# EAGLE design 80 LED WS2812 panels (EAGLE 9.6.2)
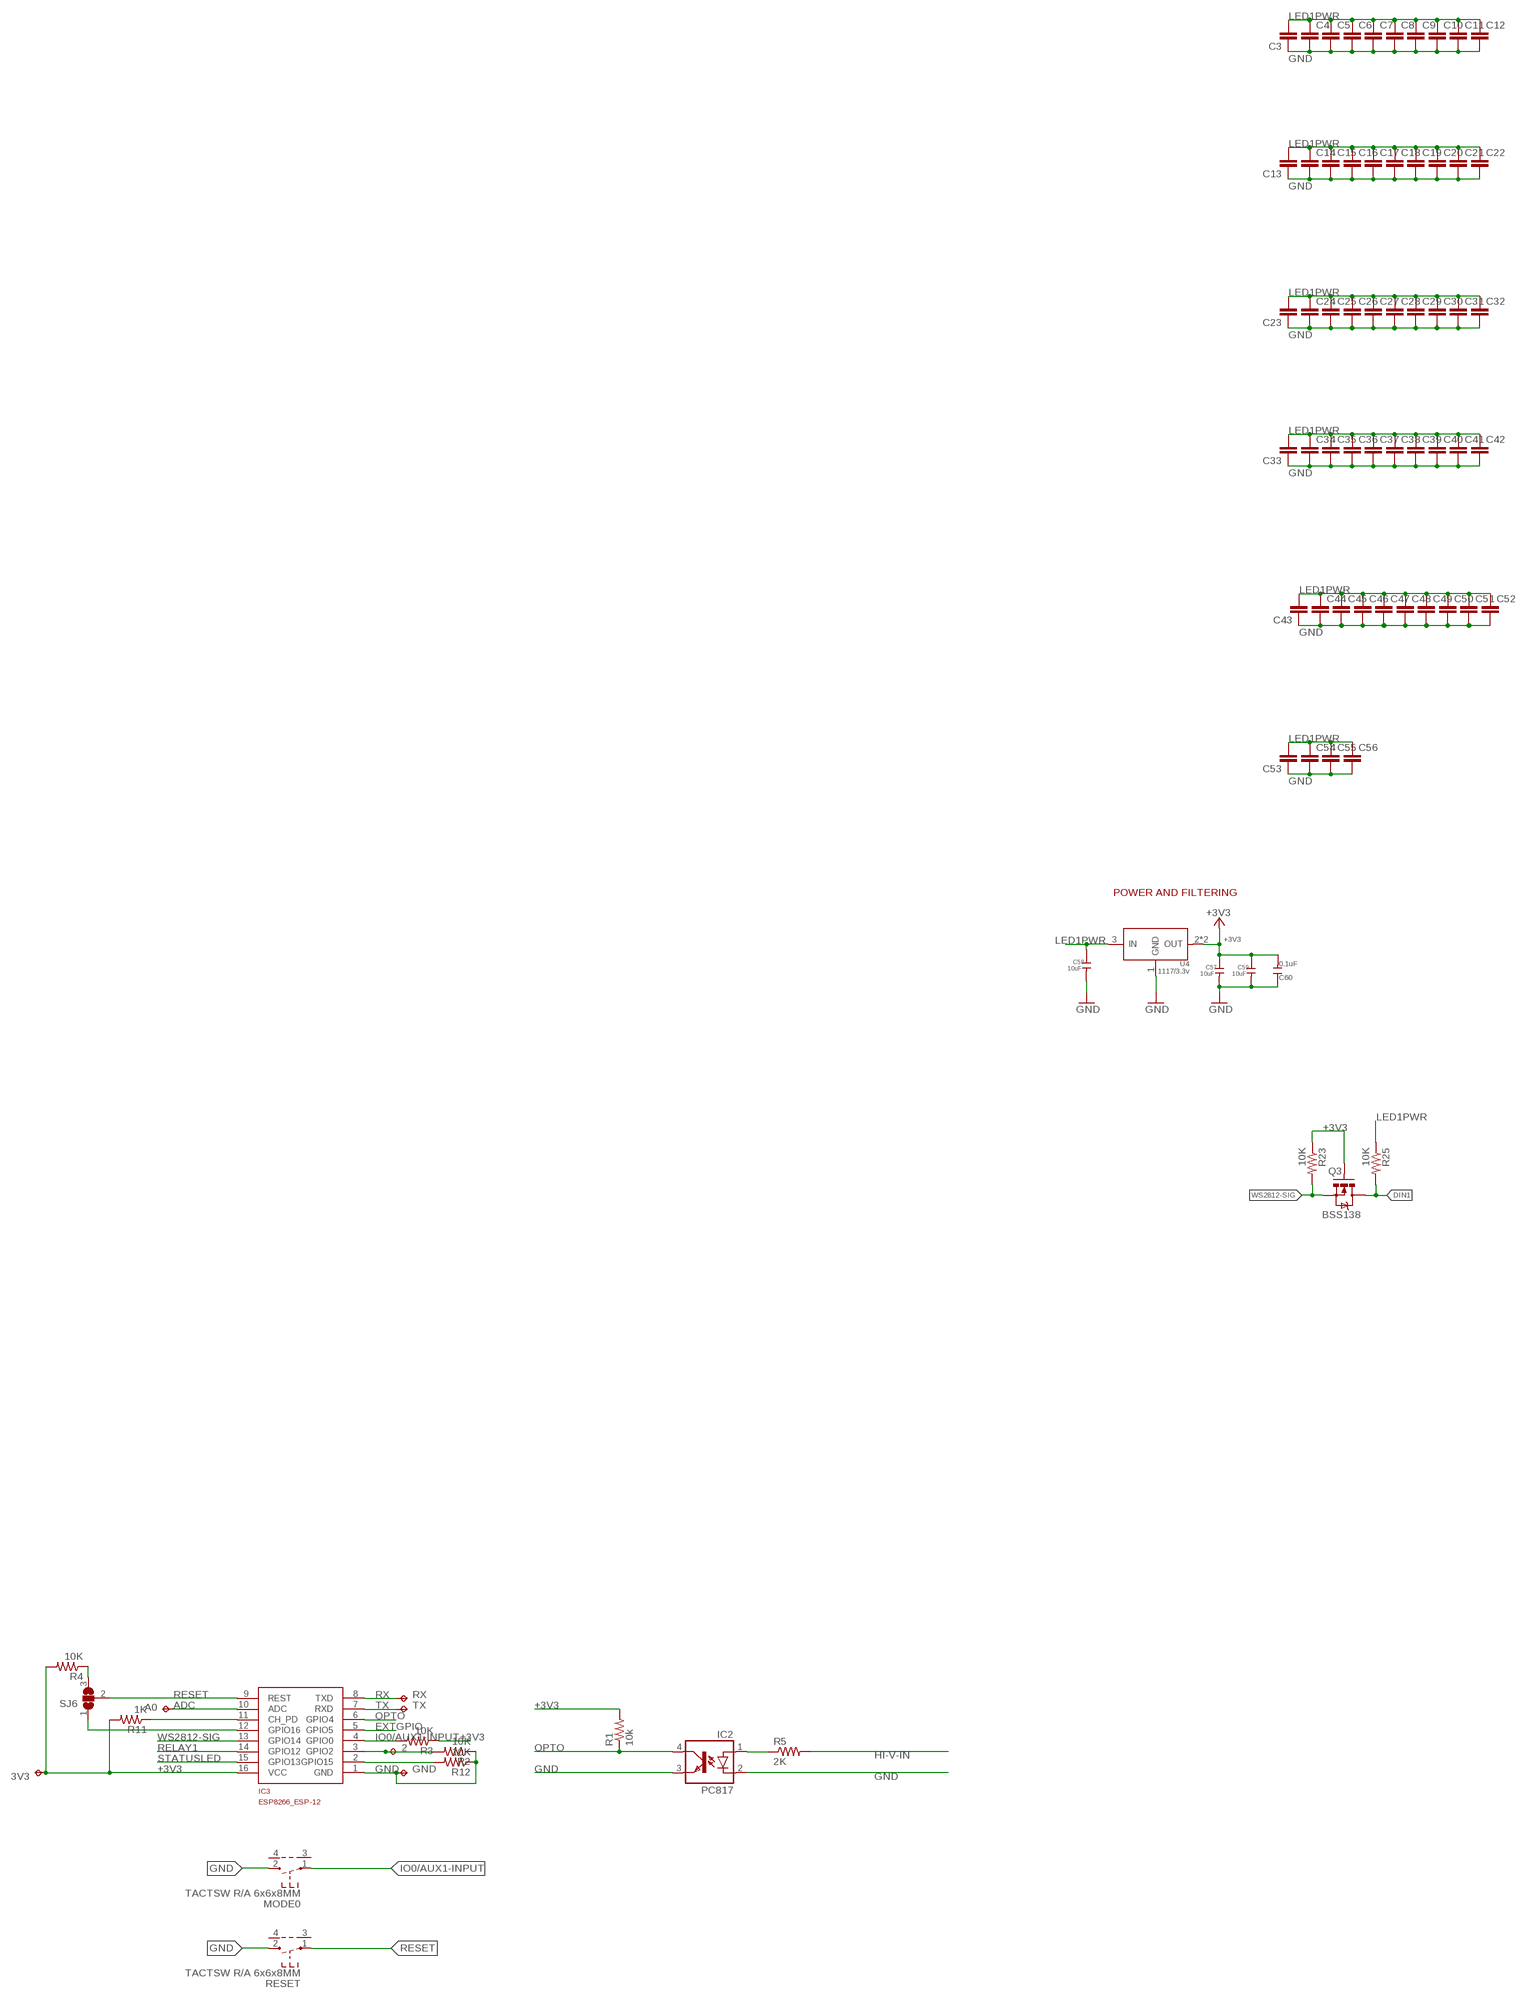
[diagram p0: schematic, sheet 1, part 1 of 2]
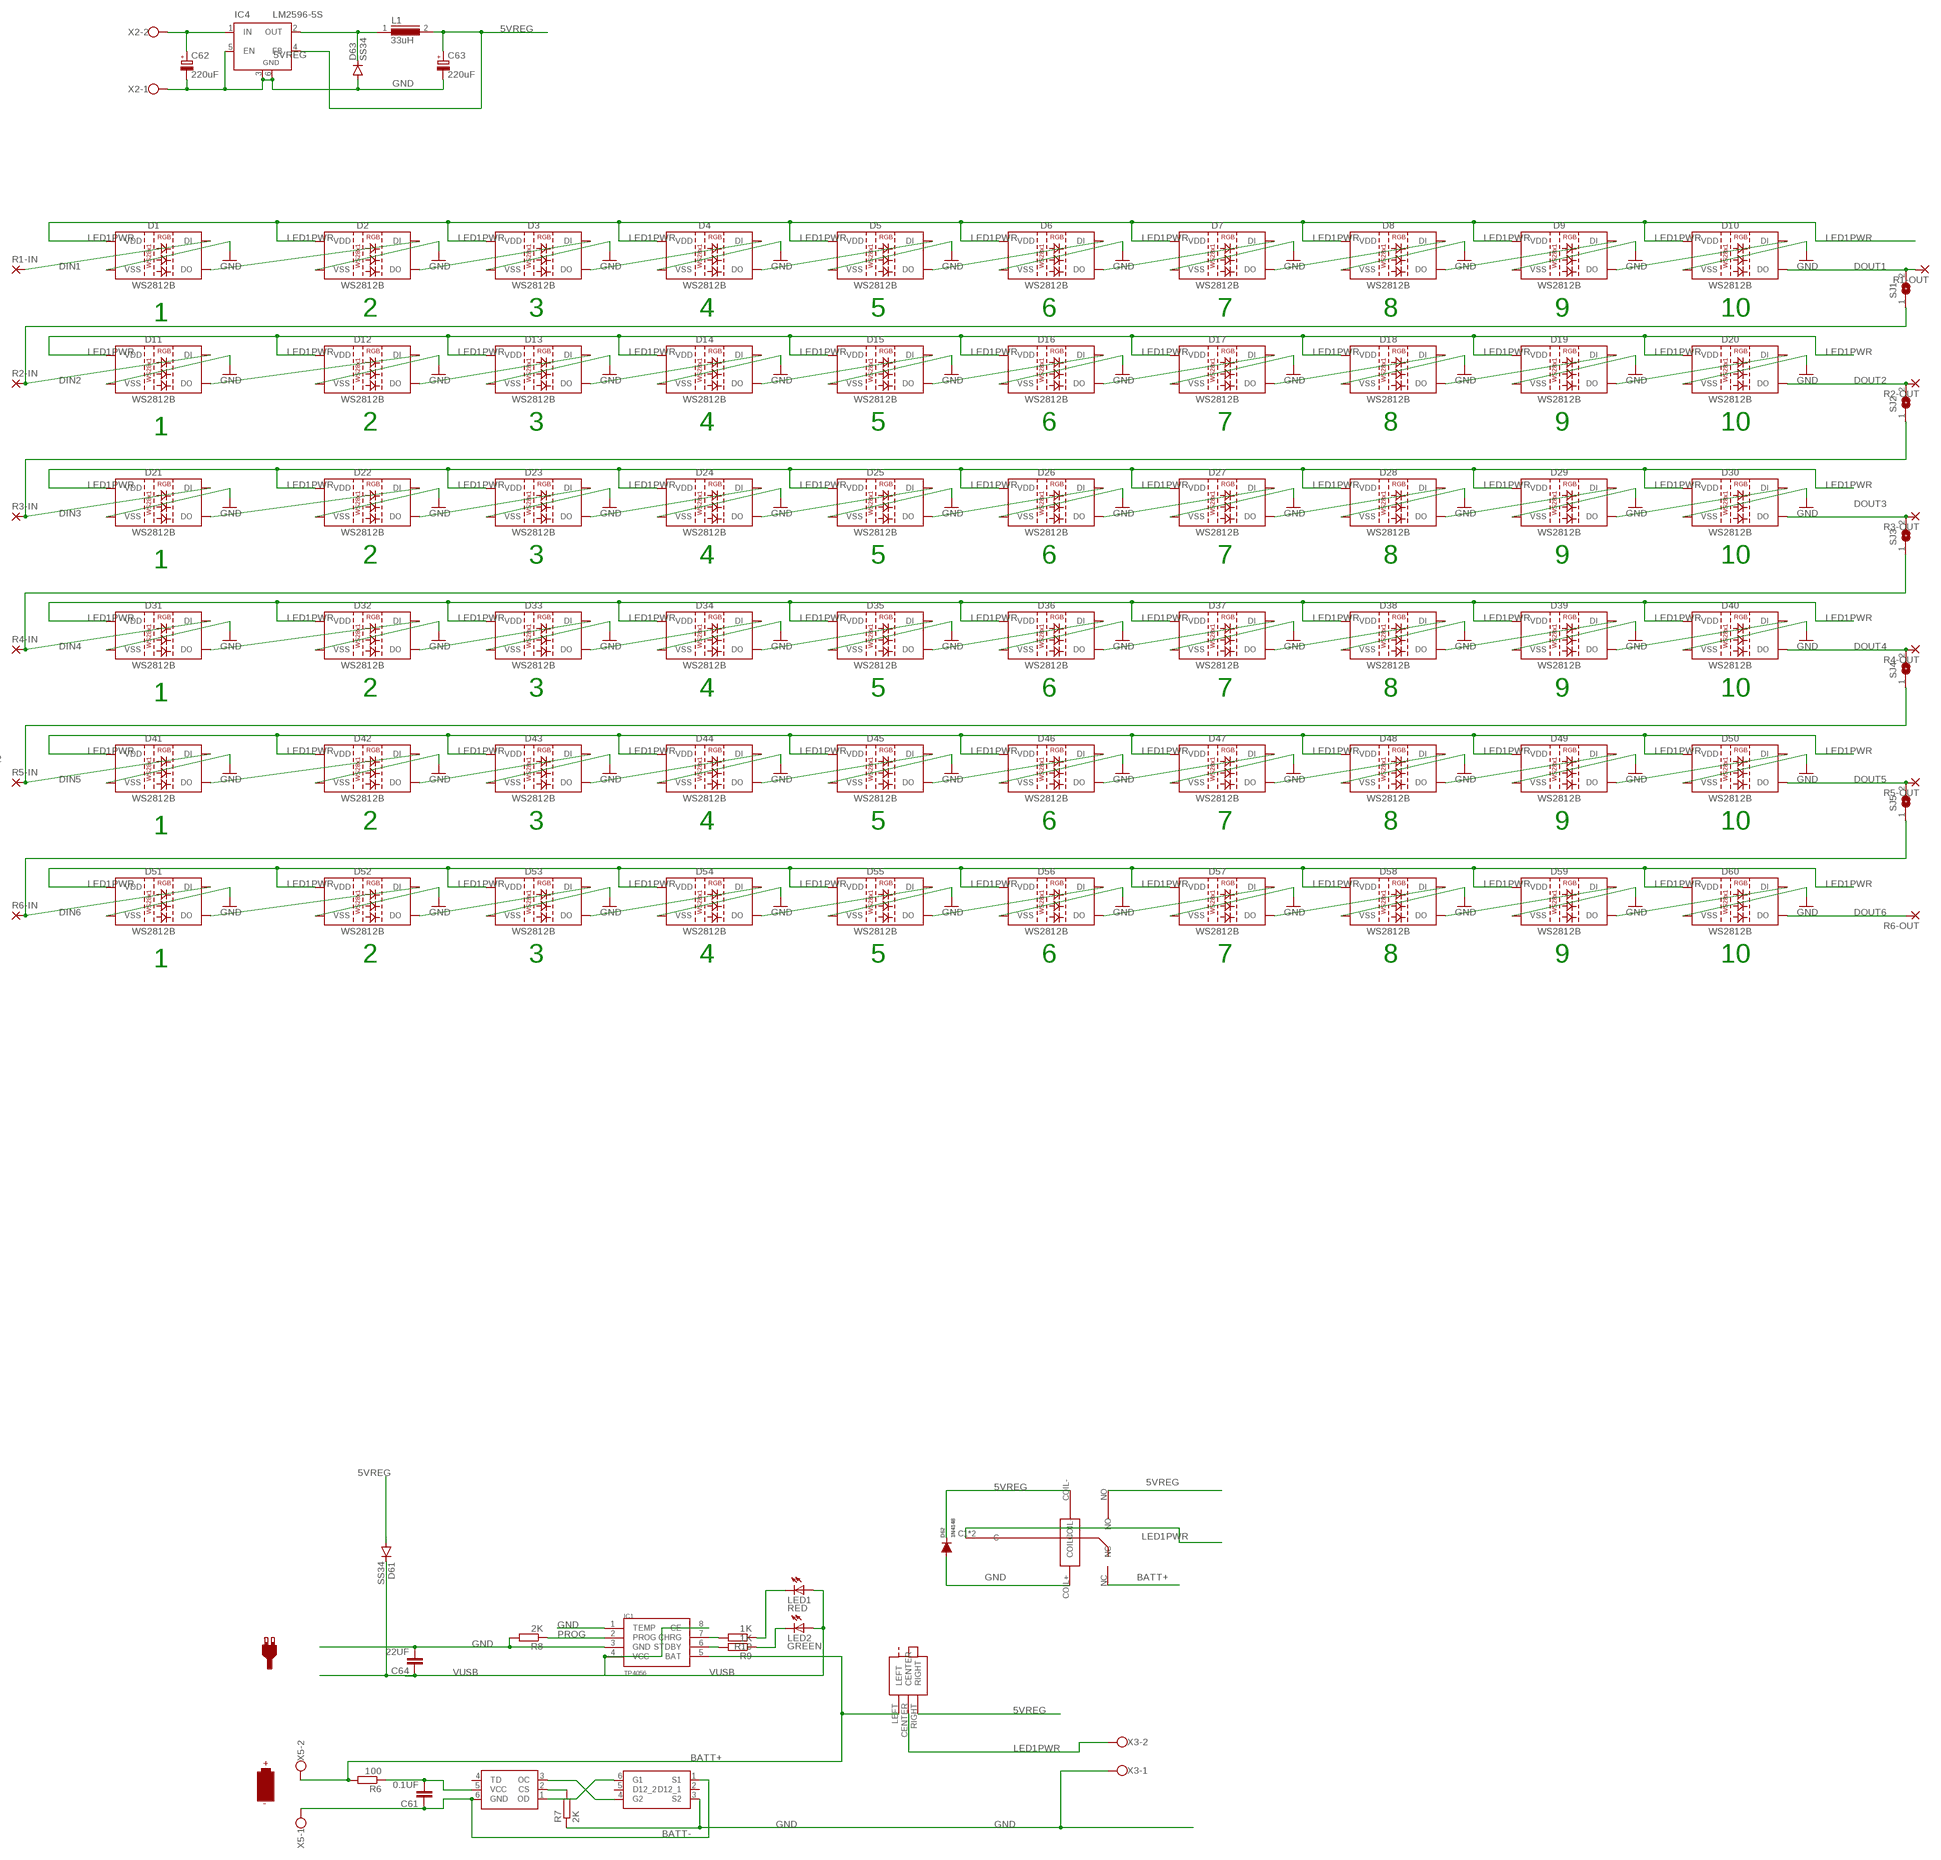
[diagram p1: schematic, sheet 1, part 2 of 2]

## Parts
2  TPTP13SQ  [TP13SQ]
3V3  TPTP13SQ  [TP13SQ]
A0  TPTP13SQ  [TP13SQ]
C3  C-EUC1206  [C1206@1]
C4  C-EUC1206  [C1206@1]
C5  C-EUC1206  [C1206@1]
C6  C-EUC1206  [C1206@1]
C7  C-EUC1206  [C1206@1]
C8  C-EUC1206  [C1206@1]
C9  C-EUC1206  [C1206@1]
C10  C-EUC1206  [C1206@1]
C11  C-EUC1206  [C1206@1]
C12  C-EUC1206  [C1206@1]
C13  C-EUC1206  [C1206@1]
C14  C-EUC1206  [C1206@1]
C15  C-EUC1206  [C1206@1]
C16  C-EUC1206  [C1206@1]
C17  C-EUC1206  [C1206@1]
C18  C-EUC1206  [C1206@1]
C19  C-EUC1206  [C1206@1]
C20  C-EUC1206  [C1206@1]
C21  C-EUC1206  [C1206@1]
C22  C-EUC1206  [C1206@1]
C23  C-EUC1206  [C1206@1]
C24  C-EUC1206  [C1206@1]
C25  C-EUC1206  [C1206@1]
C26  C-EUC1206  [C1206@1]
C27  C-EUC1206  [C1206@1]
C28  C-EUC1206  [C1206@1]
C29  C-EUC1206  [C1206@1]
C30  C-EUC1206  [C1206@1]
C31  C-EUC1206  [C1206@1]
C32  C-EUC1206  [C1206@1]
C33  C-EUC1206  [C1206@1]
C34  C-EUC1206  [C1206@1]
C35  C-EUC1206  [C1206@1]
C36  C-EUC1206  [C1206@1]
C37  C-EUC1206  [C1206@1]
C38  C-EUC1206  [C1206@1]
C39  C-EUC1206  [C1206@1]
C40  C-EUC1206  [C1206@1]
C41  C-EUC1206  [C1206@1]
C42  C-EUC1206  [C1206@1]
C43  C-EUC1206  [C1206@1]
C44  C-EUC1206  [C1206@1]
C45  C-EUC1206  [C1206@1]
C46  C-EUC1206  [C1206@1]
C47  C-EUC1206  [C1206@1]
C48  C-EUC1206  [C1206@1]
C49  C-EUC1206  [C1206@1]
C50  C-EUC1206  [C1206@1]
C51  C-EUC1206  [C1206@1]
C52  C-EUC1206  [C1206@1]
C53  C-EUC1206  [C1206@1]
C54  C-EUC1206  [C1206@1]
C55  C-EUC1206  [C1206@1]
C56  C-EUC1206  [C1206@1]
C57  10uF  C-1206  [C1206]
C58  10uF  C-1206  [C1206]
C59  10uF  C-1206  [C1206]
C60  0.1uF  DISCRETE_C-1206  [DISCRETE_C1206]
C61  0.1UF  C-EUC1206  [C1206@1]
C62  220uF  CPOL-EUE3.5-10  [E3,5-10]
C63  220uF  CPOL-EUE3.5-10  [E3,5-10]
C64  22UF  C-EUC1812K  [C1812K@1]
D1  WS2812B  [WS2812B]
D2  WS2812B  [WS2812B]
D3  WS2812B  [WS2812B]
D4  WS2812B  [WS2812B]
D5  WS2812B  [WS2812B]
D6  WS2812B  [WS2812B]
D7  WS2812B  [WS2812B]
D8  WS2812B  [WS2812B]
D9  WS2812B  [WS2812B]
D10  WS2812B  [WS2812B]
D11  WS2812B  [WS2812B]
D12  WS2812B  [WS2812B]
D13  WS2812B  [WS2812B]
D14  WS2812B  [WS2812B]
D15  WS2812B  [WS2812B]
D16  WS2812B  [WS2812B]
D17  WS2812B  [WS2812B]
D18  WS2812B  [WS2812B]
D19  WS2812B  [WS2812B]
D20  WS2812B  [WS2812B]
D21  WS2812B  [WS2812B]
D22  WS2812B  [WS2812B]
D23  WS2812B  [WS2812B]
D24  WS2812B  [WS2812B]
D25  WS2812B  [WS2812B]
D26  WS2812B  [WS2812B]
D27  WS2812B  [WS2812B]
D28  WS2812B  [WS2812B]
D29  WS2812B  [WS2812B]
D30  WS2812B  [WS2812B]
D31  WS2812B  [WS2812B]
D32  WS2812B  [WS2812B]
D33  WS2812B  [WS2812B]
D34  WS2812B  [WS2812B]
D35  WS2812B  [WS2812B]
D36  WS2812B  [WS2812B]
D37  WS2812B  [WS2812B]
D38  WS2812B  [WS2812B]
D39  WS2812B  [WS2812B]
D40  WS2812B  [WS2812B]
D41  WS2812B  [WS2812B]
D42  WS2812B  [WS2812B]
D43  WS2812B  [WS2812B]
D44  WS2812B  [WS2812B]
D45  WS2812B  [WS2812B]
D46  WS2812B  [WS2812B]
D47  WS2812B  [WS2812B]
D48  WS2812B  [WS2812B]
D49  WS2812B  [WS2812B]
D50  WS2812B  [WS2812B]
D51  WS2812B  [WS2812B]
D52  WS2812B  [WS2812B]
D53  WS2812B  [WS2812B]
D54  WS2812B  [WS2812B]
D55  WS2812B  [WS2812B]
D56  WS2812B  [WS2812B]
D57  WS2812B  [WS2812B]
D58  WS2812B  [WS2812B]
D59  WS2812B  [WS2812B]
D60  WS2812B  [WS2812B]
D61  SS34  DIODE-DO-214AC  [DO-214AC]
D62  1N4148  DIODE-BAS16J  [SOD-323]
D63  SS34  DIODE-DO-214AC  [DO-214AC]
GND  TPTP13SQ  [TP13SQ]
IC1  TP4056  [SOP-8]
IC2  PC817  [DIL04]
IC3  ESP8266_ESP-12  [ESP8266-ESP12]
IC4  LM2596-5S  LM2596S  [TO263-5]
L1  33uH  DR127  [DR127]
LED1  RED  LED3MM  [LED3MM]
LED2  GREEN  LED3MM  [LED3MM]
MODE0  TACTSW R/A 6x6x8MM  SW_TACT_4P_B  [SW_TACT_STANDARD_RIGHT_ANGLE]
Q3  BSS138  MOSFET-NCHANNELSMD  [SOT23-3]
R1  10k  R-US_R1206  [R1206]
R1-IN  2,15/1,0  [2,15/1,0]
R1-OUT  2,15/1,0  [2,15/1,0]
R2  10K  R-US_R1206  [R1206]
R2-IN  2,15/1,0  [2,15/1,0]
R2-OUT  2,15/1,0  [2,15/1,0]
R3  10K  R-US_R1206  [R1206]
R3-IN  2,15/1,0  [2,15/1,0]
R3-OUT  2,15/1,0  [2,15/1,0]
R4  10K  R-US_R1206  [R1206]
R4-IN  2,15/1,0  [2,15/1,0]
R4-OUT  2,15/1,0  [2,15/1,0]
R5  2K  R-US_R1206  [R1206]
R5-IN  2,15/1,0  [2,15/1,0]
R5-OUT  2,15/1,0  [2,15/1,0]
R6  100  R-EU_R1206  [R1206]
R6-IN  2,15/1,0  [2,15/1,0]
R6-OUT  2,15/1,0  [2,15/1,0]
R7  2K  R-EU_R1206  [R1206]
R8  2K  R-EU_R1206  [R1206]
R9  1K  R-EU_R1206  [R1206]
R10  1K  R-EU_R1206  [R1206]
R11  1K  R-US_R1206  [R1206]
R12  10K  R-US_R1206  [R1206]
R23  10K  RESISTOR1206  [1206]
R25  10K  RESISTOR1206  [1206]
RESET  TACTSW R/A 6x6x8MM  SW_TACT_4P_B  [SW_TACT_STANDARD_RIGHT_ANGLE]
RX  TPTP13SQ  [TP13SQ]
SJ1  SJ  [SJ]
SJ2  SJ  [SJ]
SJ3  SJ  [SJ]
SJ4  SJ  [SJ]
SJ5  SJ  [SJ]
SJ6  SJ2W  [SJ_2]
TX  TPTP13SQ  [TP13SQ]
U4  1117/3.3v  LD1117S  [SOT-223]
U$1  FS312F-G  [SOT23-6]
U$2  FS8205  [SOT23-6]
U$3  XKBENTERPRISESS-12D11G5R  [XKBENTERPRISESS-12D11G5R]
U$13  JRC-21F-4100  [JRC-21F-4100]
X2  W237-102  [W237-102]
X3  W237-102  [W237-102]
X5  W237-102  [W237-102]

## Nets
5VREG: C63.+ D61.A D62.C IC4.4(FB) L1.2 U$3.RIGHT U$13.COIL- U$13.NO
+3V3: 3V3.TP C57.1 C59.1 C60.2 IC3.16(VCC) Q3.1(G) R1.2 R3.1 R4.2 R11.2 R23.1 U4.2(OUT) U4.TER(OUT)
ADC: A0.TP IC3.10(ADC)
BATT+: IC1.5(BAT) R6.2 U$3.LEFT U$13.NC X5.2
BATT-: C61.1 U$1.6(GND) U$2.1(S1) X5.1
CHG: IC1.7(CHRG) R10.2
DIN1: D1.4(DI) Q3.3(D) R1-IN.1(P) R25.2
DIN2: D11.4(DI) R2-IN.1(P) SJ1.1
DIN3: D21.4(DI) R3-IN.1(P) SJ2.1
DIN4: D31.4(DI) R4-IN.1(P) SJ3.1
DIN5: D41.4(DI) R5-IN.1(P) SJ4.1
DIN6: D51.4(DI) R6-IN.1(P) SJ5.1
DOUT1: D10.2(DO) R1-OUT.1(P) SJ1.2
DOUT2: D20.2(DO) R2-OUT.1(P) SJ2.2
DOUT3: D30.2(DO) R3-OUT.1(P) SJ3.2
DOUT4: D40.2(DO) R4-OUT.1(P) SJ4.2
DOUT5: D50.2(DO) R5-OUT.1(P) SJ5.2
DOUT6: D60.2(DO) R6-OUT.1(P)
EXTGPIO: IC3.5(GPIO5)
GND: C3.1 C4.2 C5.2 C6.2 C7.2 C8.2 C9.2 C10.2 C11.2 C12.2 C13.1 C14.2 C15.2 C16.2 C17.2 C18.2 C19.2 C20.2 C21.2 C22.2 C23.1 C24.2 C25.2 C26.2 C27.2 C28.2 C29.2 C30.2 C31.2 C32.2 C33.1 C34.2 C35.2 C36.2 C37.2 C38.2 C39.2 C40.2 C41.2 C42.2 C43.1 C44.2 C45.2 C46.2 C47.2 C48.2 C49.2 C50.2 C51.2 C52.2 C53.1 C54.2 C55.2 C56.2 C57.2 C58.2 C59.2 C60.1 C62.- C63.- C64.2 D1.3(VSS) D2.3(VSS) D3.3(VSS) D4.3(VSS) D5.3(VSS) D6.3(VSS) D7.3(VSS) D8.3(VSS) D9.3(VSS) D10.3(VSS) D11.3(VSS) D12.3(VSS) D13.3(VSS) D14.3(VSS) D15.3(VSS) D16.3(VSS) D17.3(VSS) D18.3(VSS) D19.3(VSS) D20.3(VSS) D21.3(VSS) D22.3(VSS) D23.3(VSS) D24.3(VSS) D25.3(VSS) D26.3(VSS) D27.3(VSS) D28.3(VSS) D29.3(VSS) D30.3(VSS) D31.3(VSS) D32.3(VSS) D33.3(VSS) D34.3(VSS) D35.3(VSS) D36.3(VSS) D37.3(VSS) D38.3(VSS) D39.3(VSS) D40.3(VSS) D41.3(VSS) D42.3(VSS) D43.3(VSS) D44.3(VSS) D45.3(VSS) D46.3(VSS) D47.3(VSS) D48.3(VSS) D49.3(VSS) D50.3(VSS) D51.3(VSS) D52.3(VSS) D53.3(VSS) D54.3(VSS) D55.3(VSS) D56.3(VSS) D57.3(VSS) D58.3(VSS) D59.3(VSS) D60.3(VSS) D62.A D63.A GND.TP IC1.1(TEMP) IC1.3(GND) IC2.2(C) IC2.3(EMIT) IC3.1(GND) IC4.3(GND) IC4.5(EN) IC4.6(GND) MODE0.2 R2.1 R7.1 R8.2 R12.1 RESET.2 U4.1(GND) U$2.3(S2) U$13.COIL+(COIL=) X2.1 X3.1
HI-V-IN: C62.+ IC4.1(IN) R5.2 X2.2
IO0/AUX1-INPUT: IC3.4(GPIO0) MODE0.1 R3.2
LED1PWR: C3.2 C4.1 C5.1 C6.1 C7.1 C8.1 C9.1 C10.1 C11.1 C12.1 C13.2 C14.1 C15.1 C16.1 C17.1 C18.1 C19.1 C20.1 C21.1 C22.1 C23.2 C24.1 C25.1 C26.1 C27.1 C28.1 C29.1 C30.1 C31.1 C32.1 C33.2 C34.1 C35.1 C36.1 C37.1 C38.1 C39.1 C40.1 C41.1 C42.1 C43.2 C44.1 C45.1 C46.1 C47.1 C48.1 C49.1 C50.1 C51.1 C52.1 C53.2 C54.1 C55.1 C56.1 C58.1 D1.1(VDD) D2.1(VDD) D3.1(VDD) D4.1(VDD) D5.1(VDD) D6.1(VDD) D7.1(VDD) D8.1(VDD) D9.1(VDD) D10.1(VDD) D11.1(VDD) D12.1(VDD) D13.1(VDD) D14.1(VDD) D15.1(VDD) D16.1(VDD) D17.1(VDD) D18.1(VDD) D19.1(VDD) D20.1(VDD) D21.1(VDD) D22.1(VDD) D23.1(VDD) D24.1(VDD) D25.1(VDD) D26.1(VDD) D27.1(VDD) D28.1(VDD) D29.1(VDD) D30.1(VDD) D31.1(VDD) D32.1(VDD) D33.1(VDD) D34.1(VDD) D35.1(VDD) D36.1(VDD) D37.1(VDD) D38.1(VDD) D39.1(VDD) D40.1(VDD) D41.1(VDD) D42.1(VDD) D43.1(VDD) D44.1(VDD) D45.1(VDD) D46.1(VDD) D47.1(VDD) D48.1(VDD) D49.1(VDD) D50.1(VDD) D51.1(VDD) D52.1(VDD) D53.1(VDD) D54.1(VDD) D55.1(VDD) D56.1(VDD) D57.1(VDD) D58.1(VDD) D59.1(VDD) D60.1(VDD) R25.1 U4.3(IN) U$3.CENTER U$13.C1(C) U$13.C2(C) X3.2
LEDCHR: LED1.K(C) R10.1
LEDSBY: LED2.K(C) R9.1
N$1: D19.2(DO) D20.4(DI)
N$2: D18.2(DO) D19.4(DI)
N$3: D17.2(DO) D18.4(DI)
N$4: D16.2(DO) D17.4(DI)
N$5: D15.2(DO) D16.4(DI)
N$6: D14.2(DO) D15.4(DI)
N$7: D13.2(DO) D14.4(DI)
N$8: D12.2(DO) D13.4(DI)
N$9: D11.2(DO) D12.4(DI)
N$10: D29.2(DO) D30.4(DI)
N$11: D9.2(DO) D10.4(DI)
N$12: D8.2(DO) D9.4(DI)
N$13: D7.2(DO) D8.4(DI)
N$14: D6.2(DO) D7.4(DI)
N$15: D5.2(DO) D6.4(DI)
N$16: D4.2(DO) D5.4(DI)
N$17: D3.2(DO) D4.4(DI)
N$18: D2.2(DO) D3.4(DI)
N$19: D1.2(DO) D2.4(DI)
N$20: D28.2(DO) D29.4(DI)
N$21: D27.2(DO) D28.4(DI)
N$22: D26.2(DO) D27.4(DI)
N$23: D25.2(DO) D26.4(DI)
N$24: D24.2(DO) D25.4(DI)
N$25: D23.2(DO) D24.4(DI)
N$26: D22.2(DO) D23.4(DI)
N$27: D21.2(DO) D22.4(DI)
N$28: D39.2(DO) D40.4(DI)
N$29: D38.2(DO) D39.4(DI)
N$30: D37.2(DO) D38.4(DI)
N$31: D36.2(DO) D37.4(DI)
N$32: D35.2(DO) D36.4(DI)
N$33: D34.2(DO) D35.4(DI)
N$34: D33.2(DO) D34.4(DI)
N$35: D32.2(DO) D33.4(DI)
N$36: D31.2(DO) D32.4(DI)
N$37: D49.2(DO) D50.4(DI)
N$38: D48.2(DO) D49.4(DI)
N$39: D47.2(DO) D48.4(DI)
N$40: D46.2(DO) D47.4(DI)
N$41: D45.2(DO) D46.4(DI)
N$42: D44.2(DO) D45.4(DI)
N$43: D43.2(DO) D44.4(DI)
N$44: D42.2(DO) D43.4(DI)
N$45: D41.2(DO) D42.4(DI)
N$46: D59.2(DO) D60.4(DI)
N$47: D58.2(DO) D59.4(DI)
N$48: D57.2(DO) D58.4(DI)
N$49: D56.2(DO) D57.4(DI)
N$50: D55.2(DO) D56.4(DI)
N$51: D54.2(DO) D55.4(DI)
N$52: D53.2(DO) D54.4(DI)
N$53: D52.2(DO) D53.4(DI)
N$54: D51.2(DO) D52.4(DI)
N$55: IC2.1(A) R5.1
N$56: 2.TP IC3.3(GPIO2) R2.2
N$57: R7.2 U$1.2(CS)
N$58: IC3.12(GPIO16) SJ6.1
N$59: IC3.11(CH_PD) R11.1
N$60: IC3.2(GPIO15) R12.2
N$61: R4.1 SJ6.3
N$73: D63.C IC4.2(OUT) L1.1
OC: U$1.3(OC) U$2.4(G2)
OD: U$1.1(OD) U$2.6(G1)
OPTO: IC2.4(COL) IC3.6(GPIO4) R1.1
PROG: IC1.2(PROG) R8.1
RELAY1: IC3.14(GPIO12)
RESET: IC3.9(REST) RESET.1 SJ6.2
RX: IC3.8(TXD) RX.TP
STANDBY: IC1.6(STDBY) R9.2
STATUSLED: IC3.15(GPIO13)
TX: IC3.7(RXD) TX.TP
VCC-PROT: C61.2 R6.1 U$1.5(VCC)
VUSB: C64.1 D61.C IC1.4(VCC) IC1.8(CE) LED1.A LED2.A
WS2812-SIG: IC3.13(GPIO14) Q3.2(S) R23.2
Unconnected: MODE0.3 MODE0.4 RESET.3 RESET.4 U$1.4(TD) U$2.2(D12_1) U$2.5(D12_2)

## Notes on the sheet
- 1 | 2 | 3 | 4 | 5 | 6 | 7 | 8 | 9 | 10
- 1 | 2 | 3 | 4 | 5 | 6 | 7 | 8 | 9 | 10
- 1 | 2 | 3 | 4 | 5 | 6 | 7 | 8 | 9 | 10
- 1 | 2 | 3 | 4 | 5 | 6 | 7 | 8 | 9 | 10
- 1 | 2 | 3 | 4 | 5 | 6 | 7 | 8 | 9 | 10
- 1 | 2 | 3 | 4 | 5 | 6 | 7 | 8 | 9 | 10
- POWER AND FILTERING
- +
- -

## Library data of the parts
2 3V3 A0 GND RX TX = testpad:TP: Test pad
C3-C56 C61 C64 = rcl:C-EU: CAPACITOR, European symbol
C57-C59 = discrete:C*: Ceramic Capacitors
C60 = A9G:DISCRETE_C*: Ceramic Capacitors
C62 C63 = rcl:CPOL-EU: POLARIZED CAPACITOR, European symbol; SPICEPREFIX: C
D1-D60 = SparkFun-LED:WS2812B: WS2812B SMD addressable RGB LED 5x5mm SMD LED with built-in controller IC. Color: Red/Green/Blue mC Rating: RGB: 390, 660, 180 mcd Forward Voltage: RGB: 2.0, 3.0, 3.0 V Packages:WS2812B SparkFun Products: Blynk Board - ESP8266 <https://www.sparkfun.com/products/13794>; PROD_ID: DIO-12503
D61 D63 = diode:DIODE-: DIODE
D62 = SparkFun-DiscreteSemi:DIODE: Diode These are standard reverse protection diodes and small signal diodes. SparkFun Products: SparkFun SparkPunk Sound Kit <https://www.sparkfun.com/products/11177> SparkFun ESP8266 Thing <https://www.sparkfun.com/products/13231>; PROD_ID: DIO-09646; VALUE: 250mA/100V
IC1 = TP4056:TP4056
IC2 = optocoupler:PC817: SHARP OPTO COUPLER; MPN: PC817X4J000F; OC_FARNELL: 9707727; OC_NEWARK: 97K7059
IC3 = ESP8266-ESP12:ESP8266_ESP-12: ESP8266 ESP-12 Discussion about pins here: http://www.esp8266.com/viewtopic.php?f=13&t=1429
IC4 = linear:LM2596S: STEP-DOWN VOLTAGE REGULATOR
L1 = inductors:DR127: High Power Density, High Efficiency, Shielded Inductors Source: coiltronics_dr_series.pdf; SPICEPREFIX: L
LED1 LED2 = led:LED: LED OSRAM: - CHIPLED LG R971, LG N971, LY N971, LG Q971, LY Q971, LO R971, LY R971 LH N974, LH R974 LS Q976, LO Q976, LY Q976 LO Q996 - Hyper CHIPLED LW Q18S LB Q993, LB Q99A, LB R99A - SideLED LS A670, LO A670, LY A670, LG A670, LP A670 LB A673, LV A673, LT A673, LW A673 LH A674 LY A675 LS A676, LA A676, LO A676, LY A676, LW A676 LS A679, LY A679, LG A679 - Hyper Micro SIDELED® LS Y876, LA Y876, LO Y876, LY Y876 LT Y87S - SmartLED LW L88C, LW L88S LB L89C, LB L89S, LG L890 LS L89K, LO L89K, LY L89K LS L896, LA L896, LO L896, LY L896 - TOPLED LS T670, LO T670, LY T670, LG T670, LP T670 LSG T670, LSP T670, LSY T670, LOP T670, LYG T670 LG T671, LOG T671, LSG T671 LB T673, LV T673, LT T673, LW T673 LH T674 LS T676, LA T676, LO T676, LY T676, LB T676, LH T676, LSB T676, LW T676 LB T67C, LV T67C, LT T67C, LS T67K, LO T67K, LY T67K, LW E67C LS E67B, LA E67B, LO E67B, LY E67B, LB E67C, LV E67C, LT E67C LW T67C LS T679, LY T679, LG T679 LS T770, LO T770, LY T770, LG T770, LP T770 LB T773, LV T773, LT T773, LW T773 LH T774 LS E675, LA E675, LY E675, LS T675 LS T776, LA T776, LO T776, LY T776, LB T776 LHGB T686 LT T68C, LB T68C - Hyper Mini TOPLED® LB M676 - Mini TOPLED Santana® LG M470 LS M47K, LO M47K, LY M47K Source: http://www.osram.convergy.de LUXEON: - LUMILED® LXK2-PW12-R00, LXK2-PW12-S00, LXK2-PW14-U00, LXK2-PW14-V00 LXK2-PM12-R00, LXK2-PM12-S00, LXK2-PM14-U00 LXK2-PE12-Q00, LXK2-PE12-R00, LXK2-PE12-S00, LXK2-PE14-T00, LXK2-PE14-U00 LXK2-PB12-K00, LXK2-PB12-L00, LXK2-PB12-M00, LXK2-PB14-N00, LXK2-PB14-P00, LXK2-PB14-Q00 LXK2-PR12-L00, LXK2-PR12-M00, LXK2-PR14-Q00, LXK2-PR14-R00 LXK2-PD12-Q00, LXK2-PD12-R00, LXK2-PD12-S00 LXK2-PH12-R00, LXK2-PH12-S00 LXK2-PL12-P00, LXK2-PL12-Q00, LXK2-PL12-R00 Source: www.luxeon.com KINGBRIGHT: KA-3528ASYC Source: www.kingbright.com
MODE0 RESET = dp_devices:SW_TACT_4P_B
Q3 = SparkFun:MOSFET-NCHANNEL
R1-R5 R11 R12 = resistor:R-US_: RESISTOR, American symbol
R1-IN R1-OUT R2-IN R2-OUT R3-IN R3-OUT R4-IN R4-OUT R5-IN R5-OUT R6-IN R6-OUT = wirepad:2,15/1,0: THROUGH-HOLE PAD
R6-R10 = rcl:R-EU_: RESISTOR, European symbol
R23 R25 = SparkFun:RESISTOR: Resistor Basic schematic elements and footprints for 0603, 1206, and PTH resistors.
SJ1-SJ5 = jumper:SJ: SMD solder JUMPER
SJ6 = jumper:SJ2W: SMD solder JUMPER
U4 = IC:LD1117: Low Drop Fixed And Adjustable Positive Voltage Regulators http://www.datasheetcatalog.org/datasheet/SGSThomsonMicroelectronics/mXuqtqv.pdf
U$1 = buckboost:FS312F-G
U$2 = buckboost:FS8205
U$3 = XKB Enterprise SS-12D11G5R:XKBENTERPRISESS-12D11G5R
U$13 = JRC-21F:JRC-21F-4100
X2 X3 X5 = con-wago-500:W237-102: WAGO SCREW CLAMP; MPN: 237-102; OC_FARNELL: unknown; OC_NEWARK: 70K9898

## Net classes
0 default: width 0.203 mm, clearance 0.152 mm

## Board
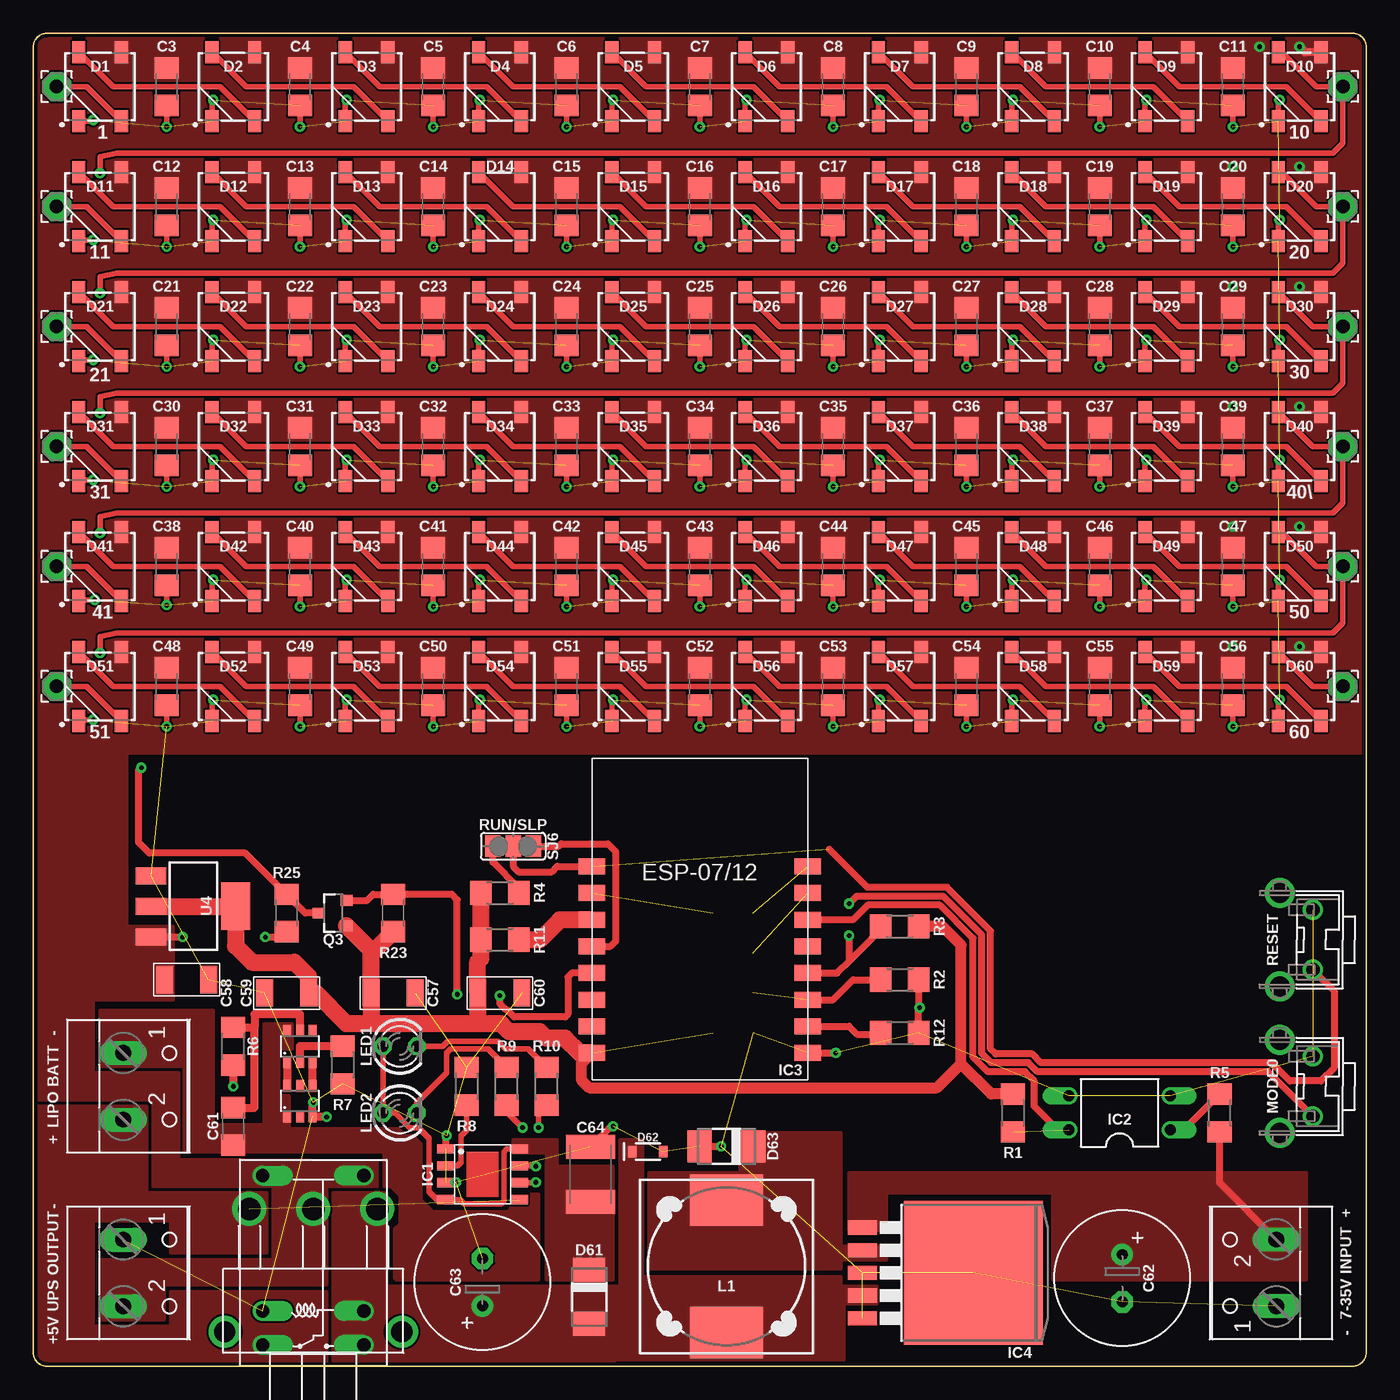
[diagram p2: board, top side]
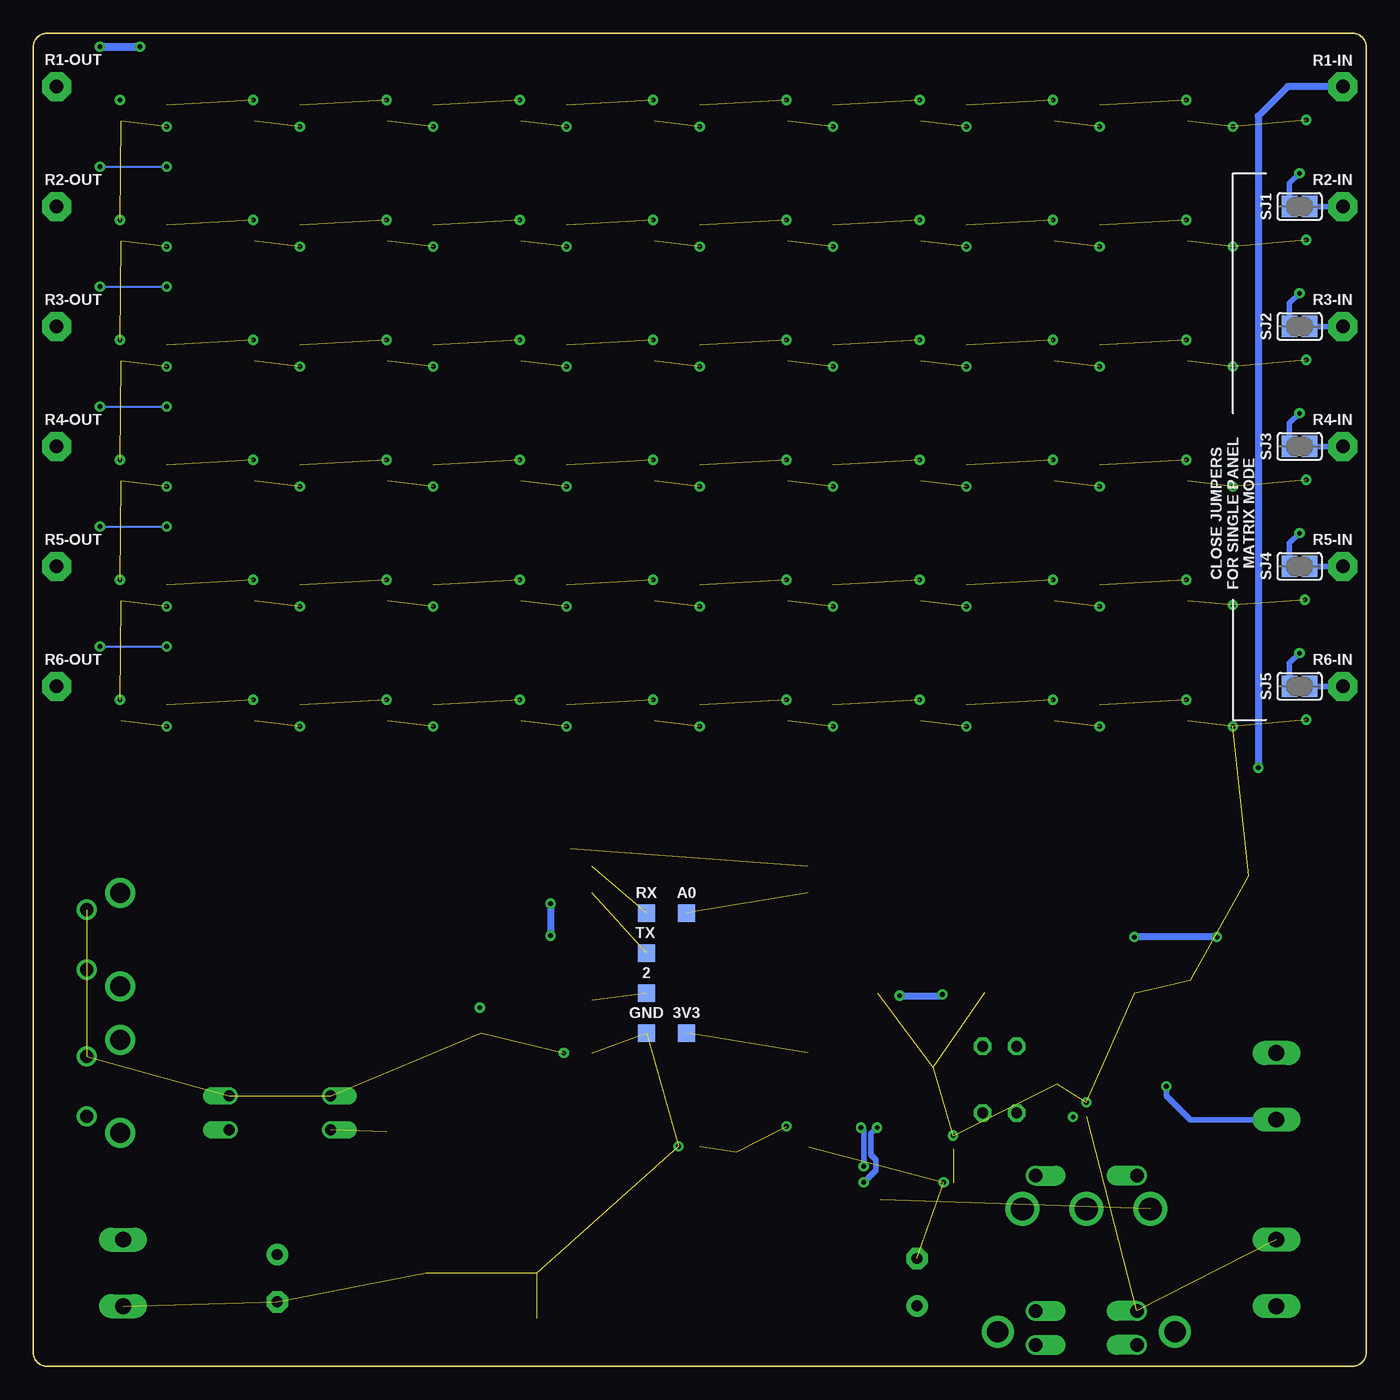
[diagram p3: board, bottom side, seen from below]

Size 100 x 100 mm. Coordinates in mm from the lower left corner, seen from the top.
Outline: 0,99 0,1 arc90 1,0 99,0 arc90 100,1 100,99 arc90 99,100 1,100 arc90 0,99
Copper layers (1*16): Top 0.035mm / dielectric 1.5mm / Bottom 0.035mm
Design rules "default *": minimum track width 6mil, minimum drill 0.35mm, track to track 6mil, track to pad 6mil, pad to pad 6mil, via to via 6mil, smd to smd 6mil, copper to edge 10mil, drill to drill 6mil, minimum pad ring 10mil, minimum via ring 8mil, stop-mask expansion 4mil, vias tented up to drill 0mil, thermal gap 10mil

### Footprints (pad centres in the part's own frame; a part is rotated, then mirrored left to right if it is on the bottom)
TP13SQ = smd 1.3 x 1.3: TP 0,0
C1206@1 = smd 1.6 x 1.8: 1 -1.4,0; 2 1.4,0
C1206 = smd 1.27 x 2.032: 1 -1.651,0; 2 1.651,0
DISCRETE_C1206 = smd 1.27 x 2.032: 1 -1.651,0; 2 1.651,0
E3,5-10 = drill 0.813 pad 1.6: + -1.778,0 | drill 0.813 pad 1.6 octagon: - 1.778,0
C1812K@1 = smd 1.8 x 3.7: 1 -2.05,0; 2 2.05,0
WS2812B = smd 1.651 x 1: 1 2.577,-1.6; 2 2.577,1.6; 3 -2.577,1.6; 4 -2.577,-1.6
DO-214AC = smd 1.8 x 2.4: A 2.025,0; C -2.025,0
SOD-323 = smd 0.63 x 0.83: A 1.15,0; C -1.15,0
SOP-8 = smd 1.3 x 0.7: 1 -2.75,1.905; 2 -2.75,0.635; 3 -2.75,-0.635; 4 -2.75,-1.905; 5 2.75,-1.905; 6 2.75,-0.635; 7 2.75,0.635; 8 2.75,1.905
DIL04 = drill 0.813 offset: 1 -1.27,-3.81; 2 1.27,-3.81; 3 1.27,3.81; 4 -1.27,3.81
ESP8266-ESP12 = smd 2 x 1.2: 1 16.2,2; 2 16.2,4; 3 16.2,6; 4 16.2,8; 5 16.2,10; 6 16.2,12; 7 16.2,14; 8 16.2,16; 9 0,16; 10 0,14; 11 0,12; 12 0,10; 13 0,8; 14 0,6; 15 0,4; 16 0,2
TO263-5 = smd 1.067 x 2.159: 1 -3.404,-5.791; 2 -1.702,-5.791; 3 0,-5.791; 4 1.702,-5.791; 5 3.404,-5.791 | smd 10.8 x 10.41: 6 0,2.54
DR127 = smd 3.85 x 5.5: 1 -4.975,0; 2 4.975,0
LED3MM = drill 0.813 octagon: A -1.27,0; K 1.27,0
SW_TACT_STANDARD_RIGHT_ANGLE = drill 1: 1 -2.25,0; 2 2.25,0 | drill 1.5: 3 -3.5,2.5; 4 3.5,2.5
SOT23-3 = smd 0.8 x 0.9: 1 -0.95,-1; 2 0.95,-1; 3 0,1.1
R1206 = smd 1.6 x 1.803: 1 -1.422,0; 2 1.422,0
2,15/1,0 = drill 1.016 pad 2.159 octagon: 1 0,0
1206 = smd 1.6 x 1.8: 1 -1.4,0; 2 1.4,0
SJ = smd 1.168 x 1.6: 1 -0.762,0; 2 0.762,0
SJ_2 = smd 1.168 x 1.6: 1 -1.524,0; 2 0,0; 3 1.524,0
SOT-223 = smd 1.27 x 2.286: 1 -2.286,-3.175; 2 0,-3.175; 3 2.286,-3.175 | smd 3.556 x 2.159: TER 0,3.175
SOT23-6 = smd 0.6 x 0.9: 1 -0.95,-1.15; 2 0,-1.15; 3 0.95,-1.15; 4 0.95,1.15; 5 0,1.15; 6 -0.95,1.15
XKBENTERPRISESS-12D11G5R = drill 1.7: CENTER 0,-10.8; LEFT 4.8,-10.8; RIGHT -4.8,-10.8 | drill 1.6: P$1 -6.65,-1.58; P$2 6.65,-1.58
JRC-21F-4100 = drill 1 offset: C1 -4.3,3.8; C2 -4.3,-3.8; COIL+ 5.85,-3.8; COIL- 5.85,3.8; NC 8.4,-3.8; NO 8.4,3.8
W237-102 = drill 1.194 long: 1 -2.5,-1.27; 2 2.5,-1.27

### Placement (x,y rotation side)
2  54,28 0 bottom
3V3  51,25 0 bottom
A0  51,34 0 bottom
C3  10,96 90 top
C4  20,96 270 top
C5  30,96 270 top
C6  40,96 270 top
C7  50,96 270 top
C8  60,96 270 top
C9  70,96 270 top
C10  80,96 270 top
C11  90,96 270 top
C12  10,87 270 top
C13  20,87 90 top
C14  30,87 270 top
C15  40,87 270 top
C16  50,87 270 top
C17  60,87 270 top
C18  70,87 270 top
C19  80,87 270 top
C20  90,87 270 top
C21  10,78 270 top
C22  20,78 270 top
C23  30,78 90 top
C24  40,78 270 top
C25  50,78 270 top
C26  60,78 270 top
C27  70,78 270 top
C28  80,78 270 top
C29  90,78 270 top
C30  10,69 270 top
C31  20,69 270 top
C32  30,69 270 top
C33  40,69 90 top
C34  50,69 270 top
C35  60,69 270 top
C36  70,69 270 top
C37  80,69 270 top
C38  10,60 270 top
C39  90,69 270 top
C40  20,60 270 top
C41  30,60 270 top
C42  40,60 270 top
C43  50,60 90 top
C44  60,60 270 top
C45  70,60 270 top
C46  80,60 270 top
C47  90,60 270 top
C48  10,51 270 top
C49  20,51 270 top
C50  30,51 270 top
C51  40,51 270 top
C52  50,51 270 top
C53  60,51 90 top
C54  70,51 270 top
C55  80,51 270 top
C56  90,51 270 top
C57  27,28 0 top
C58  11.5,29 0 top
C59  19,28 180 top
C60  35,28 180 top
C61  15,18 90 top
C62  81.7,6.6 270 top
C63  33.7,6.3 90 top
C64  41.8,14.4 90 top
D1  5,96 90 top
D2  15,96 90 top
D3  25,96 90 top
D4  35,96 90 top
D5  45,96 90 top
D6  55,96 90 top
D7  65,96 90 top
D8  75,96 90 top
D9  85,96 90 top
D10  95,96 90 top
D11  5,87 90 top
D12  15,87 90 top
D13  25,87 90 top
D14  35,87 90 top
D15  45,87 90 top
D16  55,87 90 top
D17  65,87 90 top
D18  75,87 90 top
D19  85,87 90 top
D20  95,87 90 top
D21  5,78 90 top
D22  15,78 90 top
D23  25,78 90 top
D24  35,78 90 top
D25  45,78 90 top
D26  55,78 90 top
D27  65,78 90 top
D28  75,78 90 top
D29  85,78 90 top
D30  95,78 90 top
D31  5,69 90 top
D32  15,69 90 top
D33  25,69 90 top
D34  35,69 90 top
D35  45,69 90 top
D36  55,69 90 top
D37  65,69 90 top
D38  75,69 90 top
D39  85,69 90 top
D40  95,69 90 top
D41  5,60 90 top
D42  15,60 90 top
D43  25,60 90 top
D44  35,60 90 top
D45  45,60 90 top
D46  55,60 90 top
D47  65,60 90 top
D48  75,60 90 top
D49  85,60 90 top
D50  95,60 90 top
D51  5,51 90 top
D52  15,51 90 top
D53  25,51 90 top
D54  35,51 90 top
D55  45,51 90 top
D56  55,51 90 top
D57  65,51 90 top
D58  75,51 90 top
D59  85,51 90 top
D60  95,51 90 top
D61  41.7,5.2 270 top
D62  46.1,16.1 0 top
D63  52,16.5 180 top
GND  54,25 0 bottom
IC1  33.7,14.4 0 top
IC2  81.5,19 90 top
IC3  41.9,21.5 0 top
IC4  68,7 270 top
L1  52,7.5 270 top
LED1  27.5,24 0 top
LED2  27.5,19 0 top
MODE0  96,21 90 top
Q3  22.5,34 90 top
R1  73.5,19 90 top
R1-IN  1.75,96 0 top
R1-OUT  98.25,96 0 top
R2  65,29 180 top
R2-IN  1.75,87 0 top
R2-OUT  98.25,87 0 top
R3  65,33 180 top
R3-IN  1.75,78 0 top
R3-OUT  98.25,78 0 top
R4  35,35.5 180 top
R4-IN  1.75,69 0 top
R4-OUT  98.25,69 0 top
R5  89,19 270 top
R5-IN  1.75,60 0 top
R5-OUT  98.25,60 0 top
R6  15,24 270 top
R6-IN  1.75,51 0 top
R6-OUT  98.25,51 0 top
R7  23.2,22.6 90 top
R8  32.5,21 90 top
R9  35.5,21 270 top
R10  38.5,21 270 top
R11  35,32 180 top
R12  65,25 180 top
R23  27,34 90 top
R25  19,34 90 top
RESET  96,32 90 top
RX  54,34 0 bottom
SJ1  5,87 180 bottom
SJ2  5,78 180 bottom
SJ3  5,69 180 bottom
SJ4  5,60 180 bottom
SJ5  5,51 180 bottom
SJ6  36,39 180 top
TX  54,31 0 bottom
U4  12,34.5 270 top
U$1  20,24 0 top
U$2  20,19.9 0 top
U$3  21,1 180 top
U$13  21,10 270 top
X2  92,7 90 top
X3  8,7 270 top
X5  8,21 270 top

### Tracks (layer width: path | path; a pad name or v marks a point on that pad's centre or on a via)
5VREG
  pour Top (no thermals): 63.3,6 60.6,6 60.6,6.7 45.7,6.7 45.7,17 44,17 44,6 26.5,6 26.5,13 22.5,13 22.5,0.4 43.6,0.4 43.7,0.5 60.8,0.5 60.8,4.7 63.3,4.7
+3V3  (1 unrouted)
  Top 0.508: R23.1 27.5,32.1
  Top 0.813: IC3.16 41.1,22.7 41.1,21.5 41.7,20.9 67.8,20.9 69.6,22.7 | 69.6,22.7 69.6,31.6 68.2,33 R3.1 | R1.2 71.88,20.42 69.6,22.7
  Top 1.27: IC3.16 41,23.5 39.9,24.6 38.5,24.6 38,25.1 35.7,25.1 35.1,25.7 33.5,25.7 | 33.5,25.7 25.5,25.7 | 25.5,25.7 23.5,25.7 21.2,28 C59.1 20.65,29.25 19.6,30.3 16.4,30.3 15.18,31.52 U4.TER U4.2 | 33.5,25.7 33.35,25.85 C60.2 33.35,30.35 33.58,30.58 R11.2 R4.2 | 25.5,25.7 25.5,26 25.35,26.15 C57.1 25.35,30.95 | 25.35,30.95 R23.1 | Q3.1 25.35,31.2 25.35,30.95
ADC  (1 unrouted)
BATT+  (via drill 0.35)  (1 unrouted)
  Top 0.61: R6.2 v15,21
  Bottom 0.406: v15,21 15,20.3 13.2,18.5 X5.2
  pour Top (no thermals): 0.1,19.5 8.5,19.5 8.5,13 17.5,13 17.5,8.5 10.3,8.5 10.3,10.9 4.5,10.9 4.5,3 10.3,3 10.3,5.6 22,5.6 22,0.3 0.1,0.3
BATT-
  pour Top (no thermals): 19.4,25.7 17.3,25.7 17.3,18.1 13.5,18.1 13.5,26.7 5,26.7 5,22.5 11.3,22.5 11.3,16.1 26.3,16.1 26.3,13.5 26.8,13.5 27.5,12.8 27.5,10.7 27.1,10.3 27.1,6.6 27.2,6.5 37.9,6.5 37.9,12.9 35.8,12.9 35.8,11.8 35.6,11.6 30,11.6 29.1,12.5 29.1,16.7 28.5,17.3 27.9,17.3 27.4,17.8 19.2,17.8 19.2,20.3 18.4,20.3 18.4,23.8 19.4,23.8
CHG  (via drill 0.35)
  Top 0.406: IC1.7 37.66,15.04 v37.7,15 | v37.9,17.9 37.9,18.98 R10.2
  Bottom 0.406: v37.7,15 37.7,17.7 v37.9,17.9
DIN1  (via drill 0.35)
  Top 0.406: D1.4 4.02,96 R1-IN.1
  Top 0.508: R25.2 18.9,35.4 | Q3.3 20.4,34 R25.2 | R25.2 15.9,38.5 8.7,38.5 7.9,39.3 7.9,44.7 v8.1,44.9
  Bottom 0.508: R1-IN.1 5.9,96 8.1,93.8 v8.1,44.9
DIN2
  Top 0.406: D11.4 4.02,87 R2-IN.1
  Bottom 0.406: SJ1.1 R2-IN.1
DIN3
  Top 0.406: D21.4 4.02,78 R3-IN.1
  Bottom 0.406: SJ2.1 R3-IN.1
DIN4
  Top 0.406: D31.4 4.02,69 R4-IN.1
  Bottom 0.406: SJ3.1 R4-IN.1
DIN5
  Top 0.406: D41.4 4.02,60 R5-IN.1
  Bottom 0.406: SJ4.1 R5-IN.1
DIN6
  Top 0.406: D51.4 4.02,51 R6-IN.1
  Bottom 0.406: SJ5.1 R6-IN.1
DOUT1  (via drill 0.35)
  Top 0.406: D10.2 93.67,98.58 96.25,96 R1-OUT.1 98.25,91.75 97.5,91 6.25,91 5,90.75 v5,89.5
  Bottom 0.406: SJ1.2 5.76,88.74 v5,89.5
DOUT2  (via drill 0.35)
  Top 0.406: D20.2 93.67,89.58 96.25,87 R2-OUT.1 98.25,82.75 97.5,82 6.25,82 5,81.75 v5,80.5
  Bottom 0.406: SJ2.2 5.76,79.74 v5,80.5
DOUT3  (via drill 0.35)
  Top 0.406: D30.2 95.98,78 R3-OUT.1 98.25,73.75 97.5,73 6.25,73 5,72.75 v5,71.5
  Bottom 0.406: SJ3.2 5.76,70.74 v5,71.5
DOUT4  (via drill 0.35)
  Top 0.406: D40.2 95.98,69 R4-OUT.1 98.25,64.75 97.5,64 6.25,64 5,63.75 v5,62.5
  Bottom 0.406: SJ4.2 5.76,61.74 v5,62.5
DOUT5  (via drill 0.35)
  Top 0.406: D50.2 93.67,62.58 96.25,60 R5-OUT.1 98.25,55.75 97.5,55 6.25,55 5,54.75 v5,53.5
  Bottom 0.406: SJ5.2 5.76,52.74 v5,53.5
DOUT6
  Top 0.406: D60.2 95.98,51 R6-OUT.1
GND  (via drill 0.35)  (141 unrouted)
  Top 0.406: v4.5,93.5 4.42,93.42 D1.3 | D2.3 13.4,94.9 v13.5,95 | D3.3 23.4,94.9 v23.5,95 | D4.3 33.4,94.9 v33.5,95 | D5.3 43.4,94.9 v43.5,95 | D6.3 53.4,94.9 v53.5,95 | D7.3 63.4,94.9 v63.5,95 | D8.3 73.4,94.9 v73.5,95 | D9.3 83.4,94.9 v83.5,95 | D10.3 93.4,94.9 v93.5,95 | D20.3 93.4,85.9 v93.5,86 | D19.3 83.4,85.9 v83.5,86 | D18.3 73.4,85.9 v73.5,86 | D17.3 63.4,85.9 v63.5,86 | D16.3 53.4,85.9 v53.5,86 | D15.3 43.4,85.9 v43.5,86 | D14.3 33.4,85.9 v33.5,86 | D13.3 23.4,85.9 v23.5,86 | D12.3 13.4,85.9 v13.5,86 | D11.3 3.48,84.5 v4.5,84.5 | D21.3 3.48,75.5 v4.5,75.5 | D22.3 13.4,76.9 v13.5,77 | D23.3 23.4,76.9 v23.5,77 | D24.3 33.4,76.9 v33.5,77 | D25.3 43.4,76.9 v43.5,77 | D27.3 63.4,76.9 v63.5,77 | D26.3 53.4,76.9 v53.5,77 | D28.3 73.4,76.9 v73.5,77 | D29.3 83.4,76.9 v83.5,77 | D30.3 93.4,76.9 v93.5,77 | D40.3 93.4,67.9 v93.5,68 | D39.3 83.4,67.9 v83.5,68 | D38.3 73.4,67.9 v73.5,68 | D37.3 63.4,67.9 v63.5,68 | D36.3 53.4,67.9 v53.5,68 | D35.3 43.4,67.9 v43.5,68 | D34.3 33.4,67.9 v33.5,68 | D33.3 23.4,67.9 v23.5,68 | D32.3 13.4,67.9 v13.5,68 | D31.3 3.48,66.5 v4.5,66.5 | D41.3 3.48,57.5 v4.6,57.5 | D42.3 13.4,58.9 v13.5,59 | D43.3 23.4,58.9 v23.5,59 | D44.3 33.4,58.9 v33.5,59 | D45.3 43.4,58.9 v43.5,59 | D46.3 53.4,58.9 v53.5,59 | D47.3 63.4,58.9 v63.5,59 | D48.3 73.4,58.9 v73.5,59 | D49.3 83.4,58.9 v83.5,59 | D50.3 93.4,58.9 v93.5,59 | D51.3 3.48,48.5 v4.5,48.5 | D52.3 13.4,49.9 v13.5,50 | D53.3 23.4,49.9 v23.5,50 | D54.3 33.4,49.9 v33.5,50 | D55.3 43.4,49.9 v43.5,50 | D56.3 53.4,49.9 v53.5,50 | D57.3 63.4,49.9 v63.5,50 | D58.3 73.4,49.9 v73.5,50 | D59.3 83.4,49.9 v83.5,50 | D60.3 93.4,49.9 v93.5,50 | C3.1 v10,93 | C4.2 v20,93 | C5.2 v30,93 | C6.2 v40,93 | C7.2 v50,93 | C8.2 v60,93
  Top 0.406: C9.2 v70,93 | C10.2 v80,93 | C11.2 v90,93 | C20.2 v90,84 | C19.2 v80,84 | C18.2 v70,84 | C17.2 v60,84 | C15.2 v40,84 | C14.2 v30,84 | C13.1 v20,84 | C12.2 v10,84 | C21.2 v10,75 | C22.2 v20,75 | C23.1 v30,75 | C24.2 v40,75 | C25.2 v50,75 | C26.2 v60,75 | C27.2 v70,75 | C28.2 v80,75 | C29.2 v90,75 | C39.2 v90,66 | C37.2 v80,66 | C36.2 v70,66 | C35.2 v60,66 | C34.2 v50,66 | C33.1 v40,66 | C32.2 v30,66 | C31.2 v20,66 | C30.2 v10,66 | C40.2 v20,57 | C41.2 v30,57 | C42.2 v40,57 | C43.1 v50,57 | C44.2 v60,57 | C45.2 v70,57 | C46.2 v80,57 | C47.2 v90,57 | C56.2 v90,48 | C55.2 v80,48 | C54.2 v70,48 | C53.1 v60,48 | C52.2 v50,48 | C51.2 v40,48 | C50.2 v30,48 | C49.2 v20,48 | C48.2 v10,48 | C16.2 v50,84 | C38.2 v10,57.1
  Top 0.508: R12.1 66.42,26.82 v66.5,26.9 66.42,26.98 R2.1 | IC3.1 v60.2,23.5 | IC1.1 30.95,17.25 v31,17.3 | IC1.3 31.66,13.77 v31.7,13.8 | C64.2 43.35,18 v43.5,18 | D63.A v51.6,16.5
  Top 0.61: v21,19.8 20.95,19.75 U$2.3 21.95,18.75 v22,18.7
  pour Bottom (isolate 0.254, rank 6): 221.6,4.3 221.6,104.3 321.6,104.3 321.6,4.3
HI-V-IN
  Top 0.508: X2.2 89,13.77 R5.2
  pour Top (no thermals): 64,10.2 64,13 76.5,13 76.5,6.5 95.5,6.5 95.5,14.5 61.2,14.5 61.2,10.2
IO0/AUX1-INPUT  (via drill 0.35)
  Top 0.508: IC3.4 60.3,29.5 61.3,30.5 | R3.2 63.58,32.78 61.3,30.5 | MODE0.1 92.65,22.1 75.33,22.1 74.67,22.76 71.87,22.76 71.16,23.47 71.16,32.37 68.27,35.26 61.76,35.26 v61.2,34.7 | v61.2,32.3 61.2,30.6 61.3,30.5
  Bottom 0.508: v61.2,34.7 v61.2,32.3
LED1PWR  (via drill 0.35)
  Top 0.152: D20.1 95.42,89.58 v95,90 | D30.1 95.42,80.58 v95,81 | D40.1 95.42,71.58 v95,72 | D50.1 95.42,62.58 v95,63 | D60.1 95.42,53.58 v95,54
  Top 0.508: U4.3 11.19,32.21 v11.2,32.2 | v17.4,32.2 18.6,32.2 R25.1
  Top 0.61: D10.1 95.42,98.58 v95,99
  Bottom 0.152: v95,90 v90,90 | v95,81 v90,81 | v95,72 v90,72 | v95,63 v90,63 | v95,54 v90,54
  Bottom 0.508: v11.2,32.2 v17.4,32.2
  Bottom 0.61: v95,99 v92,99
  pour Top (isolate 0.254, rank 6): 116.3,4.9 116.3,104.9 216.3,104.9 216.3,4.9
  pour Top (rank 2, no thermals): 22,6.1 9.8,6.1 9.8,3.5 5,3.5 5,8 18,8 18,13.5 9,13.5 9,20 0,20 0,100 100,100 100,46 7,46 7,33 10.5,33 10.5,27.5 4.5,27.5 4.5,22 10.9,22 10.9,15.5 25.8,15.4 25.8,13.5 22,13.5
LEDCHR
  Top 0.406: R10.1 37.12,23.8 35.41,23.8 34.85,24.36 31.07,24.36 30.71,24 LED1.K
LEDSBY
  Top 0.406: LED2.K 28.77,19.77 31,22 31,23.5 31.3,23.8 34.12,23.8 R9.1
N$1
  Top 0.406: D19.2 85.98,87 94.02,87 D20.4
N$2
  Top 0.406: D18.2 75.98,87 84.02,87 D19.4
N$3
  Top 0.406: D17.2 65.98,87 74.02,87 D18.4
N$4
  Top 0.406: D16.2 55.98,87 64.02,87 D17.4
N$5
  Top 0.406: D15.2 45.98,87 54.02,87 D16.4
N$6
  Top 0.406: D14.2 35.98,87 44.02,87 D15.4
N$7
  Top 0.406: D13.2 25.98,87 34.02,87 D14.4
N$8
  Top 0.406: D12.2 15.98,87 24.02,87 D13.4
N$9
  Top 0.406: D11.2 5.98,87 14.02,87 D12.4
N$10
  Top 0.406: D29.2 85.98,78 94.02,78 D30.4
N$11
  Top 0.406: D9.2 85.98,96 94.02,96 D10.4
N$12
  Top 0.406: D8.2 75.98,96 84.02,96 D9.4
N$13
  Top 0.406: D7.2 65.98,96 74.02,96 D8.4
N$14
  Top 0.406: D6.2 55.98,96 64.02,96 D7.4
N$15
  Top 0.406: D5.2 45.98,96 54.02,96 D6.4
N$16
  Top 0.406: D4.2 35.98,96 44.02,96 D5.4
N$17
  Top 0.406: D3.2 25.98,96 34.02,96 D4.4
N$18
  Top 0.406: D2.2 15.98,96 24.02,96 D3.4
N$19
  Top 0.406: D1.2 5.98,96 14.02,96 D2.4
N$20
  Top 0.406: D28.2 75.98,78 84.02,78 D29.4
N$21
  Top 0.406: D27.2 65.98,78 74.02,78 D28.4
N$22
  Top 0.406: D26.2 55.98,78 64.02,78 D27.4
N$23
  Top 0.406: D25.2 45.98,78 54.02,78 D26.4
N$24
  Top 0.406: D24.2 35.98,78 44.02,78 D25.4
N$25
  Top 0.406: D23.2 25.98,78 34.02,78 D24.4
N$26
  Top 0.406: D22.2 15.98,78 24.02,78 D23.4
N$27
  Top 0.406: D21.2 5.98,78 14.02,78 D22.4
N$28
  Top 0.406: D39.2 85.98,69 94.02,69 D40.4
N$29
  Top 0.406: D38.2 75.98,69 84.02,69 D39.4
N$30
  Top 0.406: D37.2 65.98,69 74.02,69 D38.4
N$31
  Top 0.406: D36.2 55.98,69 64.02,69 D37.4
N$32
  Top 0.406: D35.2 45.98,69 54.02,69 D36.4
N$33
  Top 0.406: D34.2 35.98,69 44.02,69 D35.4
N$34
  Top 0.406: D33.2 25.98,69 34.02,69 D34.4
N$35
  Top 0.406: D32.2 15.98,69 24.02,69 D33.4
N$36
  Top 0.406: D31.2 5.98,69 14.02,69 D32.4
N$37
  Top 0.406: D49.2 85.98,60 94.02,60 D50.4
N$38
  Top 0.406: D48.2 75.98,60 84.02,60 D49.4
N$39
  Top 0.406: D47.2 65.98,60 74.02,60 D48.4
N$40
  Top 0.406: D46.2 55.98,60 64.02,60 D47.4
N$41
  Top 0.406: D45.2 45.98,60 54.02,60 D46.4
N$42
  Top 0.406: D44.2 35.98,60 44.02,60 D45.4
N$43
  Top 0.406: D43.2 25.98,60 34.02,60 D44.4
N$44
  Top 0.406: D42.2 15.98,60 24.02,60 D43.4
N$45
  Top 0.406: D41.2 5.98,60 14.02,60 D42.4
N$46
  Top 0.406: D59.2 85.98,51 94.02,51 D60.4
N$47
  Top 0.406: D58.2 75.98,51 84.02,51 D59.4
N$48
  Top 0.406: D57.2 65.98,51 74.02,51 D58.4
N$49
  Top 0.406: D56.2 55.98,51 64.02,51 D57.4
N$50
  Top 0.406: D55.2 45.98,51 54.02,51 D56.4
N$51
  Top 0.406: D54.2 35.98,51 44.02,51 D55.4
N$52
  Top 0.406: D53.2 25.98,51 34.02,51 D54.4
N$53
  Top 0.406: D52.2 15.98,51 24.02,51 D53.4
N$54
  Top 0.406: D51.2 5.98,51 14.02,51 D52.4
N$55
  Top 0.508: IC2.1 86.31,17.73 R5.1
N$56  (1 unrouted)
  Top 0.508: IC3.3 60,27.5 61.5,29 R2.2
N$57
  Top 0.61: U$1.2 20,24 23.18,24 R7.2
N$58
  Top 0.508: IC3.12 43.3,31.5 43.7,31.9 43.7,38.6 43.1,39.2 39.6,39.2 39.4,39 SJ6.1
N$59
  Top 1.27: IC3.11 39.5,33.5 38,32 R11.1
N$60
  Top 0.508: IC3.2 61.2,25.5 61.8,24.9 63.48,24.9 R12.2
N$61
  Top 0.508: R4.1 36.42,35.88 34.48,37.82 SJ6.3
N$73
  pour Top (no thermals): 64,8 60.6,8 60.6,7.3 46.2,7.3 46.2,14.5 53,14.5 53,17.5 60.6,17.5 60.6,9 64,9
OC
  Top 0.61: U$2.4 U$1.3
OD
  Top 0.61: U$1.1 U$2.6
OPTO  (1 unrouted)
  Top 0.508: IC2.4 76.87,17.73 75.1,19.5 75.1,21.4 74.4,22.1 71.6,22.1 70.5,23.2 70.5,32.1 68,34.6 62.6,34.6 61.5,33.5 IC3.6
PROG
  Top 0.406: IC1.2 31.84,15.04 32.1,15.3 32.1,17.3 32.5,17.7 R8.1
RESET  (1 unrouted)
  Top 0.508: RESET.1 97.6,28.15 97.6,22.4 96.6,21.4 94.28,21.4 92.92,22.76 75.61,22.76 74.95,23.42 72.2,23.42 71.82,23.8 71.82,32.65 68.55,35.92 62.58,35.92 59.7,38.8 | SJ6.2 36,37.5 36.4,37.1 38.9,37.1 39.3,37.5 IC3.9
RX  (1 unrouted)
STANDBY  (via drill 0.35)
  Top 0.406: IC1.6 37.66,13.77 v37.7,13.8 | v36.7,17.9 35.5,19.1 R9.2
  Bottom 0.406: v37.7,13.8 36.8,14.7 36.8,15.5 37.14,15.84 37.14,17.46 v36.7,17.9
TX  (1 unrouted)
VCC-PROT
  Top 0.61: U$1.5 20,26.4 16.6,26.4 16.6,25.42 | C61.2 16.6,19.4 16.6,25.42 | R6.1 16.6,25.42
VUSB
  Top 0.406: IC1.8 35.51,16.3 35.3,16.1 35.3,12.4 35.1,12.2 32.3,12.2 32.01,12.49 IC1.4 30.3,12.49 29.7,13.1 29.7,17.1 28.9,17.9 28.23,17.9 27.13,19 LED2.A LED1.A
  pour Top (no thermals): 38.5,6.5 43.5,6.5 43.5,15 39.3,15 39.3,17 36,17 36,16 38.5,16
WS2812-SIG  (via drill 0.35)
  Top 0.508: Q3.2 25.05,34.95 25.5,35.4 R23.2 31.4,35.4 31.8,35 v31.8,27.9 | IC3.13 40.4,29.5 40.1,29.2 40.1,26.4 39.9,26.2 36.07,26.2 35.53,26.74 35.46,26.74 35,27.2 v35,27.8
  Bottom 0.508: v35,27.8 31.9,27.8 v31.8,27.9
(copper drawn outside any net)
  shapes: Bottom area x5

### Text on the board
tPlace: 1 | 10 | 11 | 20 | 30 | 21 | 31 | 40\ | 41 | 50 | 51 | 60 | RUN/SLP | - | LIPO BATT | + | - | + | 5V UPS OUTPUT | 7-35V INPUT | + | -
bPlace: CLOSE JUMPERS / FOR SINGLE PANEL / MATRIX MODE